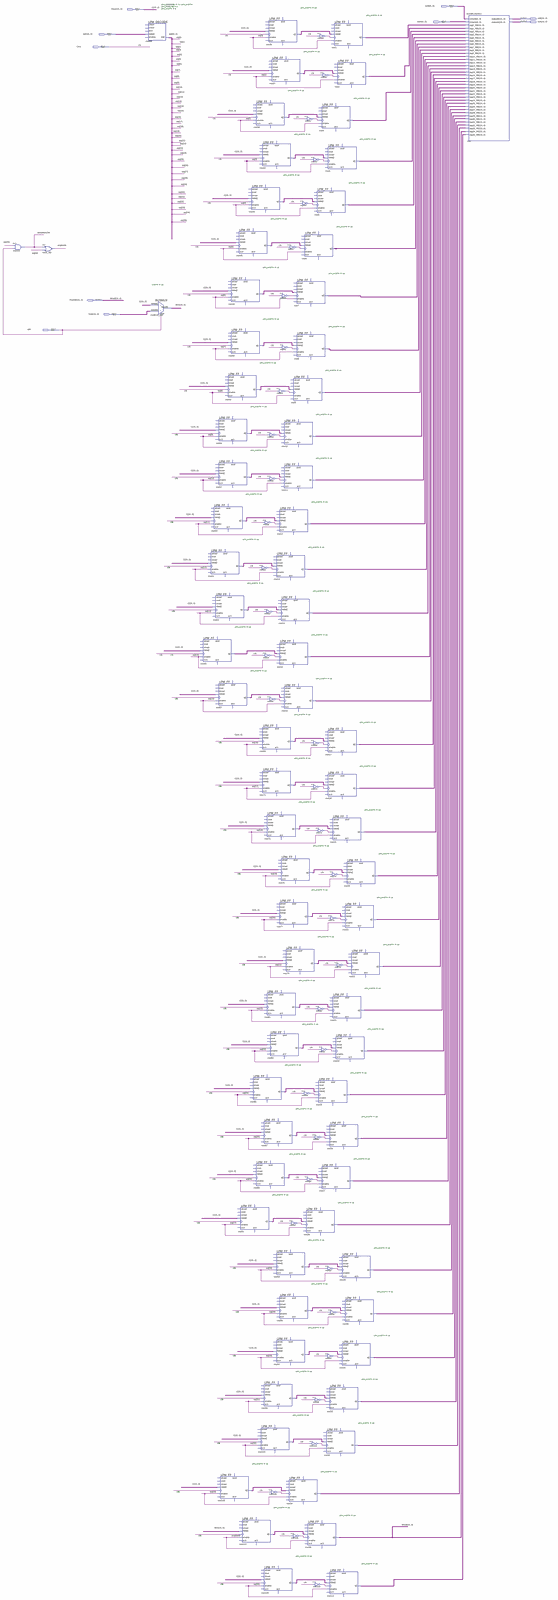
[diagram p0: schematic sheet, whole]
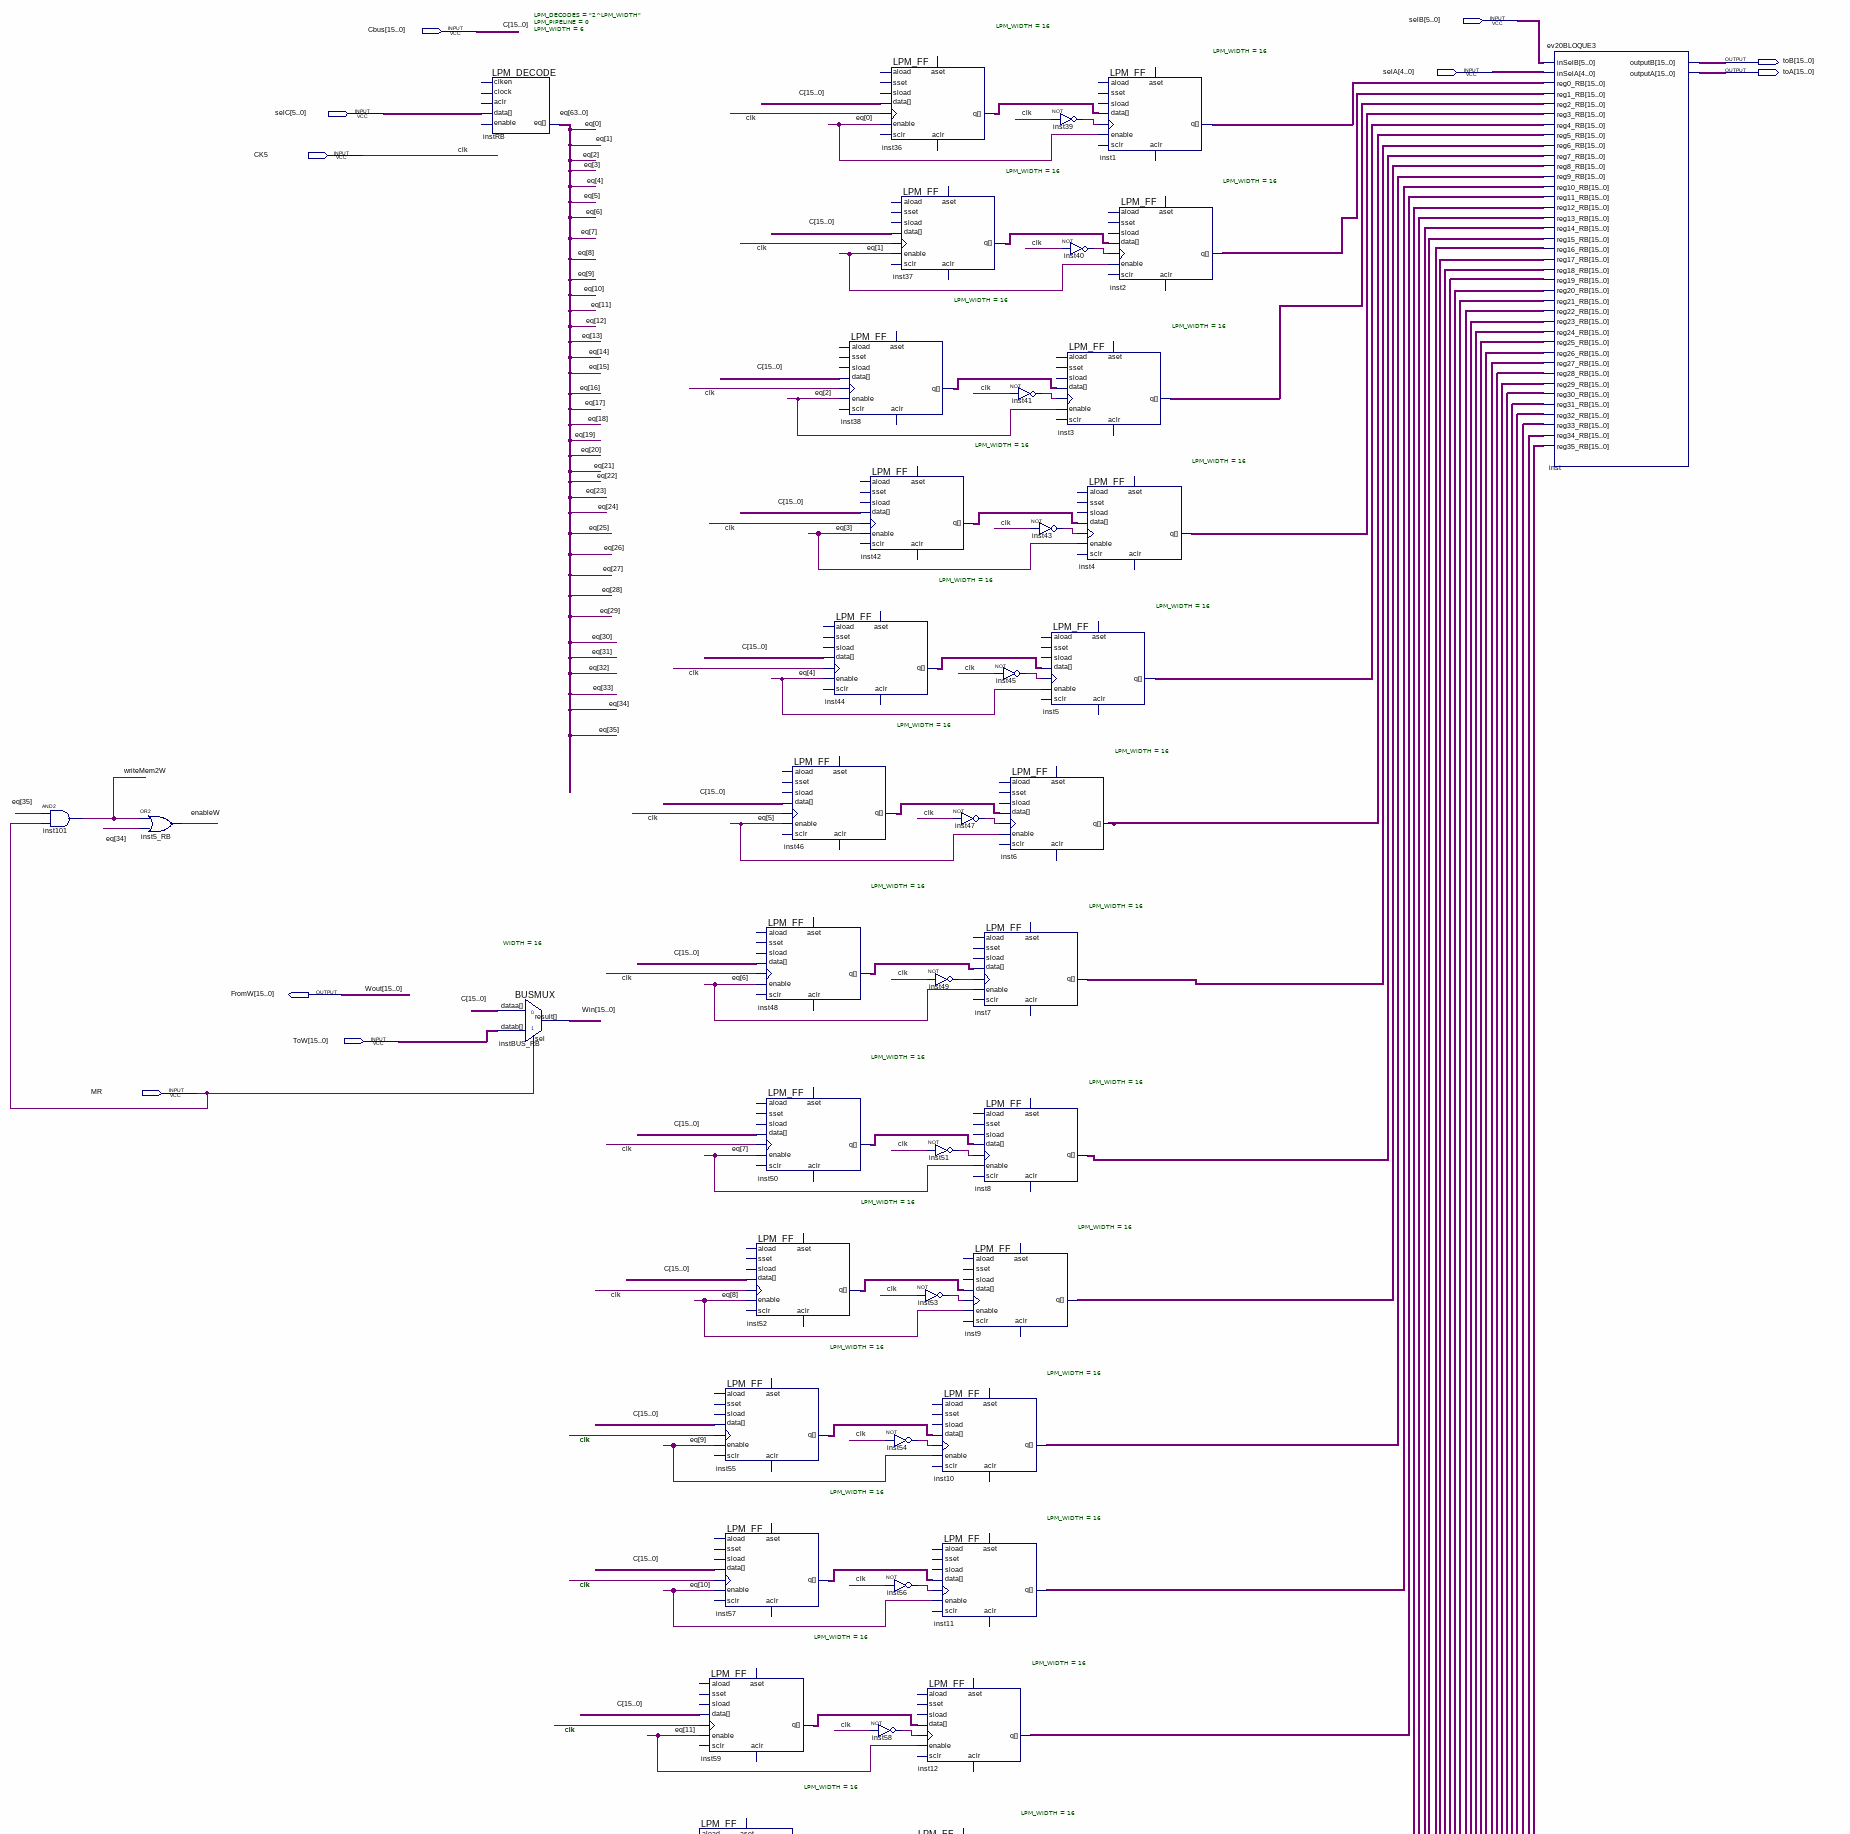
[diagram p1: schematic sheet, upper part]
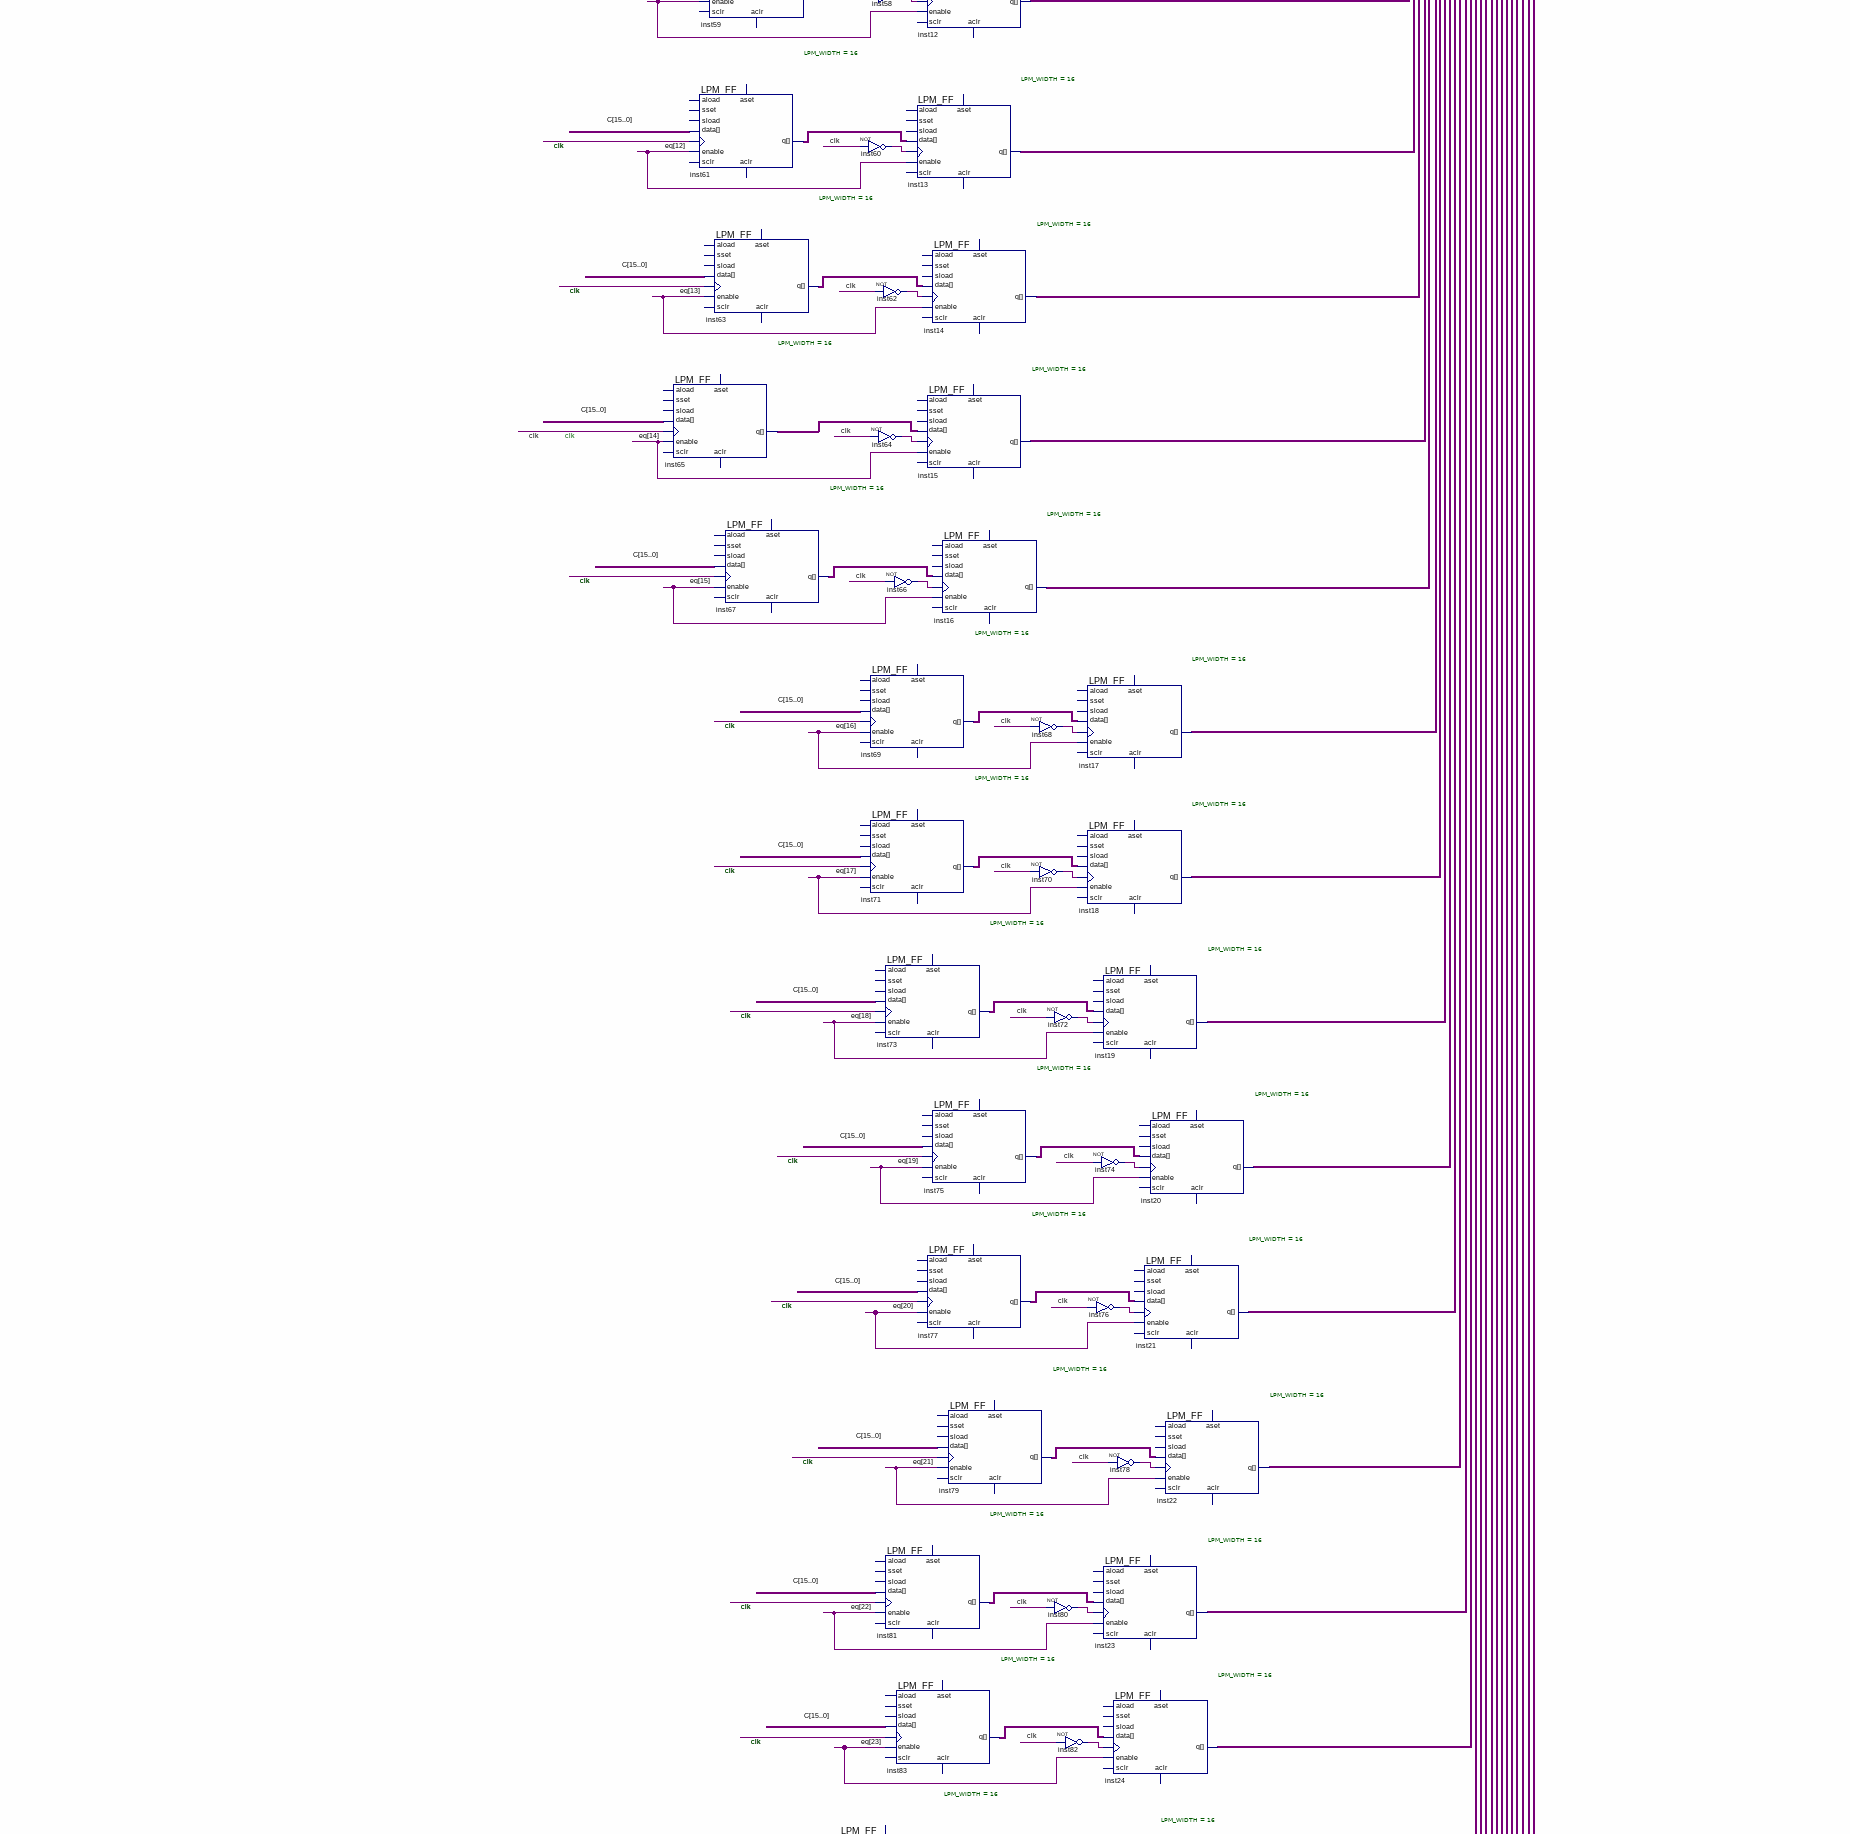
[diagram p2: schematic sheet, middle part]
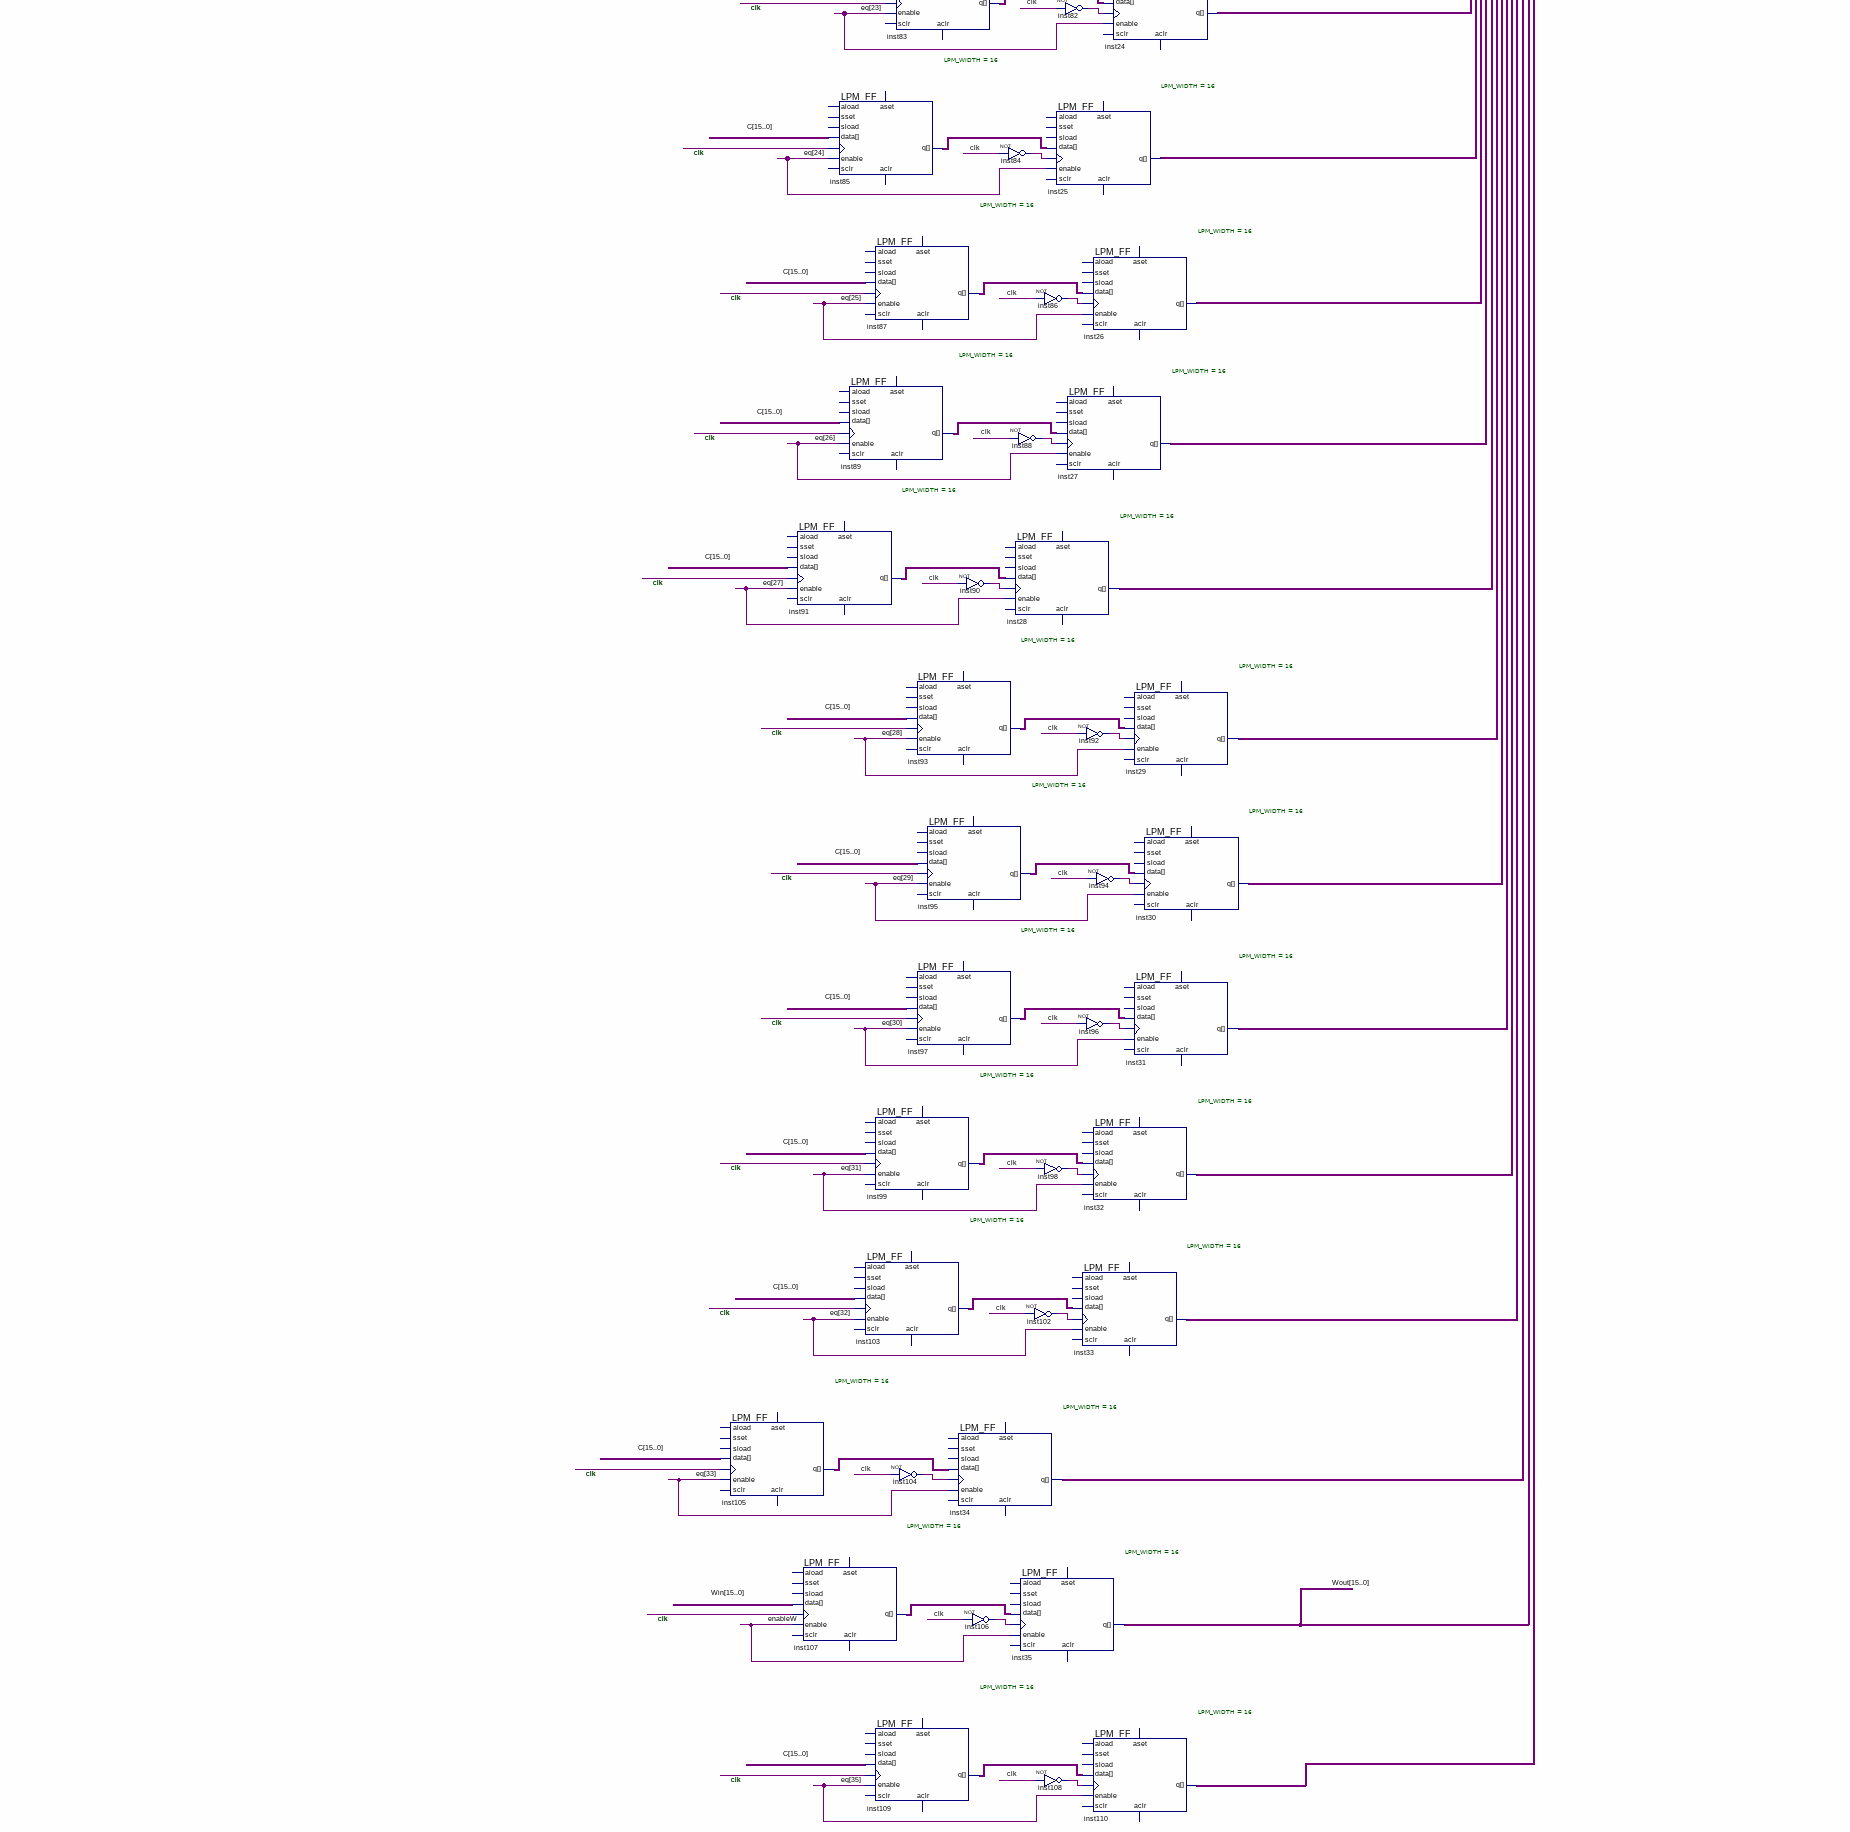
[diagram p3: schematic sheet, lower part]
// Quartus schematic ev20registerBank.bdf as structural Verilog: 113 symbols, 10 pins
module ev20registerBank (
  input  [5:0] selB,
  input  [15:0] Cbus,
  input  [4:0] selA,
  input  [5:0] selC,
  input  CK5,
  input  [15:0] ToW,
  input  MR,
  output [15:0] toB,
  output [15:0] toA,
  output [15:0] FromW
);

  wire enableW, inst39_out, inst40_out, inst41_out, inst43_out, inst45_out, inst47_out, inst49_out,
       inst51_out, inst53_out, inst54_out, inst56_out, inst58_out, inst60_out, inst62_out, inst64_out,
       inst66_out, inst68_out, inst70_out, inst72_out, inst74_out, inst76_out, inst78_out, inst80_out,
       inst82_out, inst84_out, inst86_out, inst88_out, inst90_out, inst92_out, inst94_out, inst96_out,
       inst98_out, inst102_out, inst104_out, inst106_out, inst108_out, writeMem2W;
  wire [15:0] inst1_q, inst2_q, inst3_q, inst4_q, inst5_q, inst6_q, inst7_q, inst8_q, inst9_q, inst10_q,
       inst11_q, inst12_q, inst13_q, inst14_q, inst15_q, inst16_q, inst17_q, inst18_q, inst19_q, inst20_q,
       inst21_q, inst22_q, inst23_q, inst24_q, inst25_q, inst26_q, inst27_q, inst28_q, inst29_q, inst30_q,
       inst31_q, inst32_q, inst33_q, inst34_q, inst36_q, inst37_q, inst38_q, inst42_q, inst44_q, inst46_q,
       inst48_q, inst50_q, inst52_q, inst55_q, inst57_q, inst59_q, inst61_q, inst63_q, inst65_q, inst67_q,
       inst69_q, inst71_q, inst73_q, inst75_q, inst77_q, inst79_q, inst81_q, inst83_q, inst85_q, inst87_q,
       inst89_q, inst91_q, inst93_q, inst95_q, inst97_q, inst99_q, inst103_q, inst105_q, inst107_q,
       inst109_q, inst110_q, Win;
  wire [63:0] eq;

  and inst101 (writeMem2W, eq[35], MR);
  or inst5_RB (enableW, writeMem2W, eq[34]);
  LPM_DECODE #(.LPM_DECODES("2^LPM_WIDTH"), .LPM_PIPELINE(0), .LPM_WIDTH(6)) instRB (
    .data(selC), .eq(eq));  // open: enable, clken, clock, aclr
  BUSMUX #(.WIDTH(16)) instBUS_RB (.datab(ToW), .sel(MR), .dataa(Cbus), .result(Win));
  LPM_FF #(.LPM_WIDTH(16)) inst59 (
    .enable(eq[11]), .clock(CK5), .data(Cbus), .q(inst59_q));  // open: aload, sset, sload, aset, sclr, aclr
  LPM_FF #(.LPM_WIDTH(16)) inst61 (
    .enable(eq[12]), .clock(CK5), .data(Cbus), .q(inst61_q));  // open: aload, sset, sload, aset, sclr, aclr
  LPM_FF #(.LPM_WIDTH(16)) inst65 (
    .enable(eq[14]), .clock(CK5), .data(Cbus), .q(inst65_q));  // open: aload, sset, sload, aset, sclr, aclr
  LPM_FF #(.LPM_WIDTH(16)) inst55 (
    .enable(eq[9]), .clock(CK5), .data(Cbus), .q(inst55_q));  // open: aload, sset, sload, aset, sclr, aclr
  LPM_FF #(.LPM_WIDTH(16)) inst57 (
    .enable(eq[10]), .clock(CK5), .data(Cbus), .q(inst57_q));  // open: aload, sset, sload, aset, sclr, aclr
  LPM_FF #(.LPM_WIDTH(16)) inst63 (
    .enable(eq[13]), .clock(CK5), .data(Cbus), .q(inst63_q));  // open: aload, sset, sload, aset, sclr, aclr
  LPM_FF #(.LPM_WIDTH(16)) inst67 (
    .enable(eq[15]), .clock(CK5), .data(Cbus), .q(inst67_q));  // open: aload, sset, sload, aset, sclr, aclr
  LPM_FF #(.LPM_WIDTH(16)) inst105 (
    .enable(eq[33]), .clock(CK5), .data(Cbus), .q(inst105_q));  // open: aload, sset, sload, aset, sclr, aclr
  LPM_FF #(.LPM_WIDTH(16)) inst46 (
    .enable(eq[5]), .clock(CK5), .data(Cbus), .q(inst46_q));  // open: aload, sset, sload, aset, sclr, aclr
  LPM_FF #(.LPM_WIDTH(16)) inst48 (
    .enable(eq[6]), .clock(CK5), .data(Cbus), .q(inst48_q));  // open: aload, sset, sload, aset, sclr, aclr
  LPM_FF #(.LPM_WIDTH(16)) inst50 (
    .enable(eq[7]), .clock(CK5), .data(Cbus), .q(inst50_q));  // open: aload, sset, sload, aset, sclr, aclr
  LPM_FF #(.LPM_WIDTH(16)) inst52 (
    .enable(eq[8]), .clock(CK5), .data(Cbus), .q(inst52_q));  // open: aload, sset, sload, aset, sclr, aclr
  LPM_FF #(.LPM_WIDTH(16)) inst44 (
    .enable(eq[4]), .clock(CK5), .data(Cbus), .q(inst44_q));  // open: aload, sset, sload, aset, sclr, aclr
  LPM_FF #(.LPM_WIDTH(16)) inst91 (
    .enable(eq[27]), .clock(CK5), .data(Cbus), .q(inst91_q));  // open: aload, sset, sload, aset, sclr, aclr
  LPM_FF #(.LPM_WIDTH(16)) inst107 (
    .enable(enableW), .clock(CK5), .data(Win), .q(inst107_q));  // open: aload, sset, sload, aset, sclr, aclr
  LPM_FF #(.LPM_WIDTH(16)) inst38 (
    .enable(eq[2]), .clock(CK5), .data(Cbus), .q(inst38_q));  // open: aload, sset, sload, aset, sclr, aclr
  LPM_FF #(.LPM_WIDTH(16)) inst42 (
    .enable(eq[3]), .clock(CK5), .data(Cbus), .q(inst42_q));  // open: aload, sset, sload, aset, sclr, aclr
  not inst60 (inst60_out, CK5);
  LPM_FF #(.LPM_WIDTH(16)) inst69 (
    .enable(eq[16]), .clock(CK5), .data(Cbus), .q(inst69_q));  // open: aload, sset, sload, aset, sclr, aclr
  LPM_FF #(.LPM_WIDTH(16)) inst71 (
    .enable(eq[17]), .clock(CK5), .data(Cbus), .q(inst71_q));  // open: aload, sset, sload, aset, sclr, aclr
  LPM_FF #(.LPM_WIDTH(16)) inst85 (
    .enable(eq[24]), .clock(CK5), .data(Cbus), .q(inst85_q));  // open: aload, sset, sload, aset, sclr, aclr
  LPM_FF #(.LPM_WIDTH(16)) inst87 (
    .enable(eq[25]), .clock(CK5), .data(Cbus), .q(inst87_q));  // open: aload, sset, sload, aset, sclr, aclr
  LPM_FF #(.LPM_WIDTH(16)) inst89 (
    .enable(eq[26]), .clock(CK5), .data(Cbus), .q(inst89_q));  // open: aload, sset, sload, aset, sclr, aclr
  LPM_FF #(.LPM_WIDTH(16)) inst99 (
    .enable(eq[31]), .clock(CK5), .data(Cbus), .q(inst99_q));  // open: aload, sset, sload, aset, sclr, aclr
  LPM_FF #(.LPM_WIDTH(16)) inst103 (
    .enable(eq[32]), .clock(CK5), .data(Cbus), .q(inst103_q));  // open: aload, sset, sload, aset, sclr, aclr
  LPM_FF #(.LPM_WIDTH(16)) inst109 (
    .enable(eq[35]), .clock(CK5), .data(Cbus), .q(inst109_q));  // open: aload, sset, sload, aset, sclr, aclr
  LPM_FF #(.LPM_WIDTH(16)) inst36 (
    .enable(eq[0]), .clock(CK5), .data(Cbus), .q(inst36_q));  // open: aload, sset, sload, aset, sclr, aclr
  LPM_FF #(.LPM_WIDTH(16)) inst37 (
    .enable(eq[1]), .clock(CK5), .data(Cbus), .q(inst37_q));  // open: aload, sset, sload, aset, sclr, aclr
  not inst54 (inst54_out, CK5);
  not inst56 (inst56_out, CK5);
  not inst58 (inst58_out, CK5);
  LPM_FF #(.LPM_WIDTH(16)) inst13 (
    .enable(eq[12]), .clock(inst60_out), .data(inst61_q), .q(inst13_q));  // open: aload, sset, sload, aset, sclr, aclr
  not inst62 (inst62_out, CK5);
  not inst64 (inst64_out, CK5);
  not inst66 (inst66_out, CK5);
  LPM_FF #(.LPM_WIDTH(16)) inst73 (
    .enable(eq[18]), .clock(CK5), .data(Cbus), .q(inst73_q));  // open: aload, sset, sload, aset, sclr, aclr
  LPM_FF #(.LPM_WIDTH(16)) inst81 (
    .enable(eq[22]), .clock(CK5), .data(Cbus), .q(inst81_q));  // open: aload, sset, sload, aset, sclr, aclr
  LPM_FF #(.LPM_WIDTH(16)) inst83 (
    .enable(eq[23]), .clock(CK5), .data(Cbus), .q(inst83_q));  // open: aload, sset, sload, aset, sclr, aclr
  LPM_FF #(.LPM_WIDTH(16)) inst93 (
    .enable(eq[28]), .clock(CK5), .data(Cbus), .q(inst93_q));  // open: aload, sset, sload, aset, sclr, aclr
  LPM_FF #(.LPM_WIDTH(16)) inst97 (
    .enable(eq[30]), .clock(CK5), .data(Cbus), .q(inst97_q));  // open: aload, sset, sload, aset, sclr, aclr
  not inst104 (inst104_out, CK5);
  not inst49 (inst49_out, CK5);
  not inst51 (inst51_out, CK5);
  not inst53 (inst53_out, CK5);
  LPM_FF #(.LPM_WIDTH(16)) inst10 (
    .enable(eq[9]), .clock(inst54_out), .data(inst55_q), .q(inst10_q));  // open: aload, sset, sload, aset, sclr, aclr
  LPM_FF #(.LPM_WIDTH(16)) inst11 (
    .enable(eq[10]), .clock(inst56_out), .data(inst57_q), .q(inst11_q));  // open: aload, sset, sload, aset, sclr, aclr
  LPM_FF #(.LPM_WIDTH(16)) inst12 (
    .enable(eq[11]), .clock(inst58_out), .data(inst59_q), .q(inst12_q));  // open: aload, sset, sload, aset, sclr, aclr
  LPM_FF #(.LPM_WIDTH(16)) inst14 (
    .enable(eq[13]), .clock(inst62_out), .data(inst63_q), .q(inst14_q));  // open: aload, sset, sload, aset, sclr, aclr
  LPM_FF #(.LPM_WIDTH(16)) inst15 (
    .enable(eq[14]), .clock(inst64_out), .data(inst65_q), .q(inst15_q));  // open: aload, sset, sload, aset, sclr, aclr
  LPM_FF #(.LPM_WIDTH(16)) inst16 (
    .enable(eq[15]), .clock(inst66_out), .data(inst67_q), .q(inst16_q));  // open: aload, sset, sload, aset, sclr, aclr
  LPM_FF #(.LPM_WIDTH(16)) inst75 (
    .enable(eq[19]), .clock(CK5), .data(Cbus), .q(inst75_q));  // open: aload, sset, sload, aset, sclr, aclr
  LPM_FF #(.LPM_WIDTH(16)) inst77 (
    .enable(eq[20]), .clock(CK5), .data(Cbus), .q(inst77_q));  // open: aload, sset, sload, aset, sclr, aclr
  LPM_FF #(.LPM_WIDTH(16)) inst79 (
    .enable(eq[21]), .clock(CK5), .data(Cbus), .q(inst79_q));  // open: aload, sset, sload, aset, sclr, aclr
  LPM_FF #(.LPM_WIDTH(16)) inst95 (
    .enable(eq[29]), .clock(CK5), .data(Cbus), .q(inst95_q));  // open: aload, sset, sload, aset, sclr, aclr
  LPM_FF #(.LPM_WIDTH(16)) inst34 (
    .enable(eq[33]), .clock(inst104_out), .data(inst105_q), .q(inst34_q));  // open: aload, sset, sload, aset, sclr, aclr
  not inst47 (inst47_out, CK5);
  LPM_FF #(.LPM_WIDTH(16)) inst7 (
    .enable(eq[6]), .clock(inst49_out), .data(inst48_q), .q(inst7_q));  // open: aload, sset, sload, aset, sclr, aclr
  LPM_FF #(.LPM_WIDTH(16)) inst8 (
    .enable(eq[7]), .clock(inst51_out), .data(inst50_q), .q(inst8_q));  // open: aload, sset, sload, aset, sclr, aclr
  LPM_FF #(.LPM_WIDTH(16)) inst9 (
    .enable(eq[8]), .clock(inst53_out), .data(inst52_q), .q(inst9_q));  // open: aload, sset, sload, aset, sclr, aclr
  not inst90 (inst90_out, CK5);
  not inst106 (inst106_out, CK5);
  not inst41 (inst41_out, CK5);
  not inst43 (inst43_out, CK5);
  not inst45 (inst45_out, CK5);
  LPM_FF #(.LPM_WIDTH(16)) inst6 (
    .enable(eq[5]), .clock(inst47_out), .data(inst46_q), .q(inst6_q));  // open: aload, sset, sload, aset, sclr, aclr
  not inst68 (inst68_out, CK5);
  not inst70 (inst70_out, CK5);
  not inst84 (inst84_out, CK5);
  not inst88 (inst88_out, CK5);
  LPM_FF #(.LPM_WIDTH(16)) inst28 (
    .enable(eq[27]), .clock(inst90_out), .data(inst91_q), .q(inst28_q));  // open: aload, sset, sload, aset, sclr, aclr
  not inst102 (inst102_out, CK5);
  LPM_FF #(.LPM_WIDTH(16)) inst35 (
    .enable(enableW), .clock(inst106_out), .data(inst107_q), .q(FromW));  // open: aload, sset, sload, aset, sclr, aclr
  not inst39 (inst39_out, CK5);
  not inst40 (inst40_out, CK5);
  LPM_FF #(.LPM_WIDTH(16)) inst3 (
    .enable(eq[2]), .clock(inst41_out), .data(inst38_q), .q(inst3_q));  // open: aload, sset, sload, aset, sclr, aclr
  LPM_FF #(.LPM_WIDTH(16)) inst5 (
    .enable(eq[4]), .clock(inst45_out), .data(inst44_q), .q(inst5_q));  // open: aload, sset, sload, aset, sclr, aclr
  not inst72 (inst72_out, CK5);
  not inst80 (inst80_out, CK5);
  not inst82 (inst82_out, CK5);
  LPM_FF #(.LPM_WIDTH(16)) inst25 (
    .enable(eq[24]), .clock(inst84_out), .data(inst85_q), .q(inst25_q));  // open: aload, sset, sload, aset, sclr, aclr
  not inst86 (inst86_out, CK5);
  LPM_FF #(.LPM_WIDTH(16)) inst27 (
    .enable(eq[26]), .clock(inst88_out), .data(inst89_q), .q(inst27_q));  // open: aload, sset, sload, aset, sclr, aclr
  not inst98 (inst98_out, CK5);
  LPM_FF #(.LPM_WIDTH(16)) inst33 (
    .enable(eq[32]), .clock(inst102_out), .data(inst103_q), .q(inst33_q));  // open: aload, sset, sload, aset, sclr, aclr
  not inst108 (inst108_out, CK5);
  LPM_FF #(.LPM_WIDTH(16)) inst1 (
    .enable(eq[0]), .clock(inst39_out), .data(inst36_q), .q(inst1_q));  // open: aload, sset, sload, aset, sclr, aclr
  LPM_FF #(.LPM_WIDTH(16)) inst2 (
    .enable(eq[1]), .clock(inst40_out), .data(inst37_q), .q(inst2_q));  // open: aload, sset, sload, aset, sclr, aclr
  LPM_FF #(.LPM_WIDTH(16)) inst4 (
    .enable(eq[3]), .clock(inst43_out), .data(inst42_q), .q(inst4_q));  // open: aload, sset, sload, aset, sclr, aclr
  LPM_FF #(.LPM_WIDTH(16)) inst17 (
    .enable(eq[16]), .clock(inst68_out), .data(inst69_q), .q(inst17_q));  // open: aload, sset, sload, aset, sclr, aclr
  LPM_FF #(.LPM_WIDTH(16)) inst18 (
    .enable(eq[17]), .clock(inst70_out), .data(inst71_q), .q(inst18_q));  // open: aload, sset, sload, aset, sclr, aclr
  LPM_FF #(.LPM_WIDTH(16)) inst19 (
    .enable(eq[18]), .clock(inst72_out), .data(inst73_q), .q(inst19_q));  // open: aload, sset, sload, aset, sclr, aclr
  not inst74 (inst74_out, CK5);
  not inst76 (inst76_out, CK5);
  not inst78 (inst78_out, CK5);
  LPM_FF #(.LPM_WIDTH(16)) inst23 (
    .enable(eq[22]), .clock(inst80_out), .data(inst81_q), .q(inst23_q));  // open: aload, sset, sload, aset, sclr, aclr
  LPM_FF #(.LPM_WIDTH(16)) inst24 (
    .enable(eq[23]), .clock(inst82_out), .data(inst83_q), .q(inst24_q));  // open: aload, sset, sload, aset, sclr, aclr
  LPM_FF #(.LPM_WIDTH(16)) inst26 (
    .enable(eq[25]), .clock(inst86_out), .data(inst87_q), .q(inst26_q));  // open: aload, sset, sload, aset, sclr, aclr
  not inst92 (inst92_out, CK5);
  not inst94 (inst94_out, CK5);
  not inst96 (inst96_out, CK5);
  LPM_FF #(.LPM_WIDTH(16)) inst32 (
    .enable(eq[31]), .clock(inst98_out), .data(inst99_q), .q(inst32_q));  // open: aload, sset, sload, aset, sclr, aclr
  LPM_FF #(.LPM_WIDTH(16)) inst110 (
    .enable(eq[35]), .clock(inst108_out), .data(inst109_q), .q(inst110_q));  // open: aload, sset, sload, aset, sclr, aclr
  LPM_FF #(.LPM_WIDTH(16)) inst20 (
    .enable(eq[19]), .clock(inst74_out), .data(inst75_q), .q(inst20_q));  // open: aload, sset, sload, aset, sclr, aclr
  LPM_FF #(.LPM_WIDTH(16)) inst21 (
    .enable(eq[20]), .clock(inst76_out), .data(inst77_q), .q(inst21_q));  // open: aload, sset, sload, aset, sclr, aclr
  LPM_FF #(.LPM_WIDTH(16)) inst22 (
    .enable(eq[21]), .clock(inst78_out), .data(inst79_q), .q(inst22_q));  // open: aload, sset, sload, aset, sclr, aclr
  LPM_FF #(.LPM_WIDTH(16)) inst29 (
    .enable(eq[28]), .clock(inst92_out), .data(inst93_q), .q(inst29_q));  // open: aload, sset, sload, aset, sclr, aclr
  LPM_FF #(.LPM_WIDTH(16)) inst30 (
    .enable(eq[29]), .clock(inst94_out), .data(inst95_q), .q(inst30_q));  // open: aload, sset, sload, aset, sclr, aclr
  LPM_FF #(.LPM_WIDTH(16)) inst31 (
    .enable(eq[30]), .clock(inst96_out), .data(inst97_q), .q(inst31_q));  // open: aload, sset, sload, aset, sclr, aclr
  ev20BLOQUE3 inst (
    .inSelB(selB), .inSelA(selA), .reg0_RB(inst1_q), .reg1_RB(inst2_q), .reg2_RB(inst3_q), .reg3_RB(inst4_q),
    .reg4_RB(inst5_q), .reg5_RB(inst6_q), .reg6_RB(inst7_q), .reg7_RB(inst8_q), .reg8_RB(inst9_q),
    .reg9_RB(inst10_q), .reg10_RB(inst11_q), .reg11_RB(inst12_q), .reg12_RB(inst13_q), .reg13_RB(inst14_q),
    .reg14_RB(inst15_q), .reg15_RB(inst16_q), .reg16_RB(inst17_q), .reg17_RB(inst18_q), .reg18_RB(inst19_q),
    .reg19_RB(inst20_q), .reg20_RB(inst21_q), .reg21_RB(inst22_q), .reg22_RB(inst23_q), .reg23_RB(inst24_q),
    .reg24_RB(inst25_q), .reg25_RB(inst26_q), .reg26_RB(inst27_q), .reg27_RB(inst28_q), .reg28_RB(inst29_q),
    .reg29_RB(inst30_q), .reg30_RB(inst31_q), .reg31_RB(inst32_q), .reg32_RB(inst33_q), .reg33_RB(inst34_q),
    .reg34_RB(FromW), .reg35_RB(inst110_q), .outputB(toB), .outputA(toA));

  // Other names for the same wires on the sheet: C[15:0] = Cbus; clk = CK5; Wout[15:0] = FromW

  // Notes on the sheet:
  //   clk
  //   clk
  //   clk
  //   clk
  //   clk
  //   clk
  //   clk
  //   clk
  //   clk
  //   clk
  //   clk
  //   clk
  //   clk
  //   clk
  //   clk
  //   clk
  //   clk
  //   clk
  //   clk
  //   clk
  //   clk
  //   clk
  //   clk
  //   clk
  //   clk
  //   clk
  //   clk
endmodule
